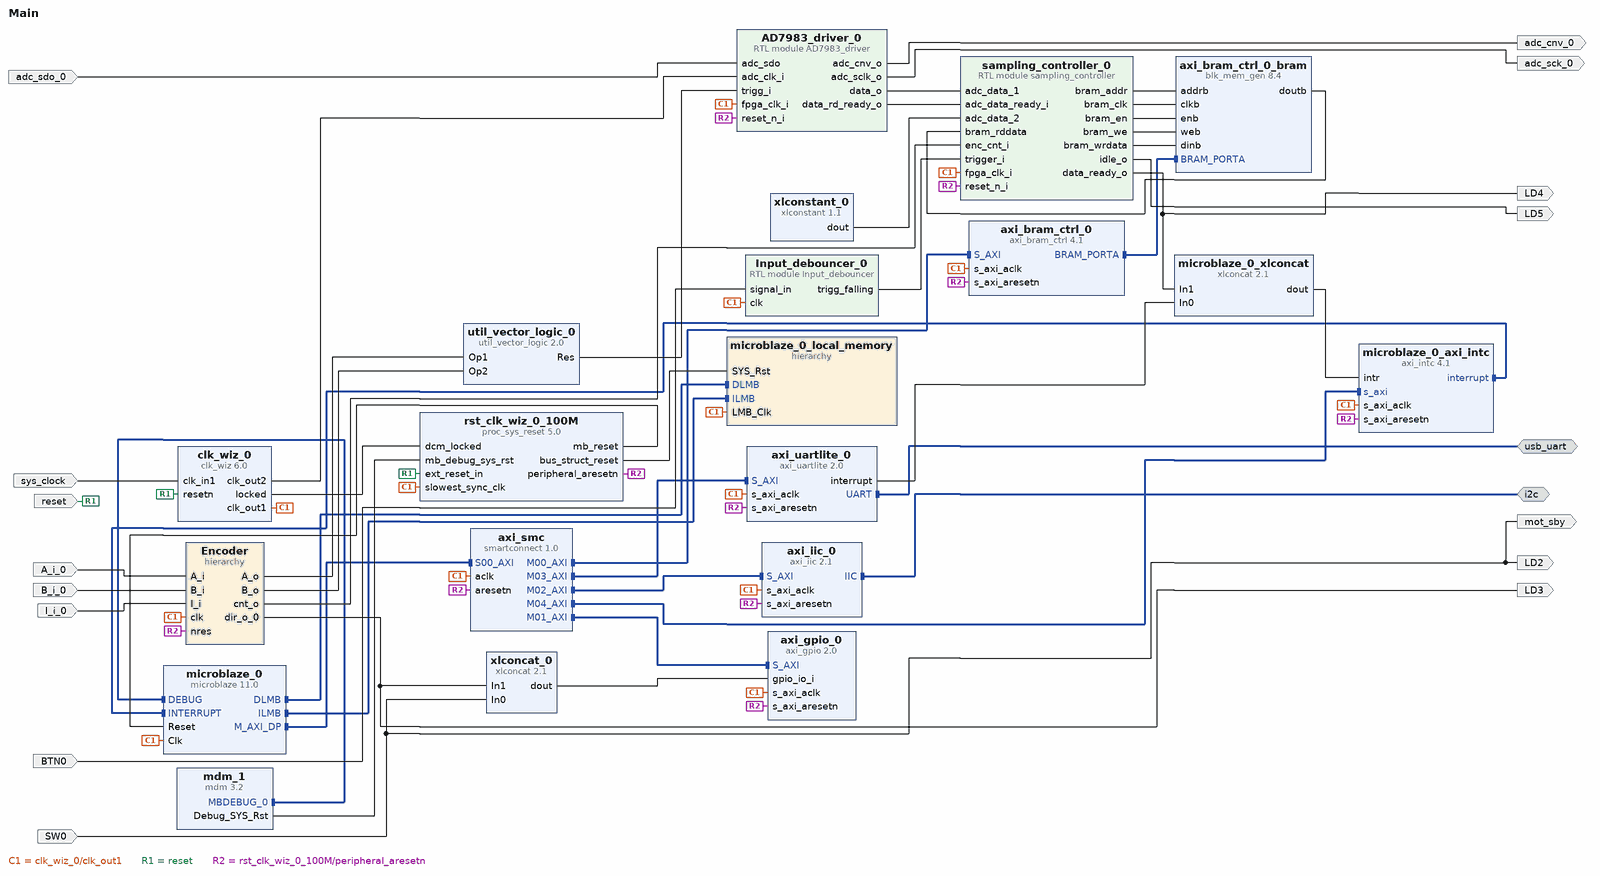
[diagram p0: block diagram of the top level]
# Vivado block design Main, xc7s25csga324-1, Vivado 2022.1
create_bd_design Main

create_bd_intf_port -mode Master -vlnv xilinx.com:interface:uart_rtl:1.0 usb_uart
create_bd_intf_port -mode Master -vlnv xilinx.com:interface:iic_rtl:1.0 i2c
create_bd_port -dir I -type clk sys_clock
set_property -dict {CONFIG.FREQ_HZ 12000000 CONFIG.PHASE 0.0} [get_bd_ports sys_clock]
create_bd_port -dir I -type rst reset
set_property -dict {CONFIG.POLARITY ACTIVE_LOW} [get_bd_ports reset]
create_bd_port -dir I adc_sdo_0
create_bd_port -dir O adc_sck_0
create_bd_port -dir O adc_cnv_0
create_bd_port -dir I A_i_0
create_bd_port -dir I SW0
create_bd_port -dir O LD2
create_bd_port -dir O mot_sby
create_bd_port -dir I I_i_0
create_bd_port -dir O LD3
create_bd_port -dir O LD4
create_bd_port -dir I BTN0
create_bd_port -dir I B_i_0
create_bd_port -dir O LD5

create_bd_cell -type ip -vlnv xilinx.com:ip:microblaze:11.0 microblaze_0
set_property -dict [list \
  CONFIG.C_DEBUG_ENABLED 1 \
  CONFIG.C_D_AXI 1 \
  CONFIG.C_D_LMB 1 \
  CONFIG.C_I_LMB 1 \
  CONFIG.G_USE_EXCEPTIONS 1 \
] [get_bd_cells microblaze_0]
create_bd_cell -type ip -vlnv xilinx.com:ip:clk_wiz:6.0 clk_wiz_0
set_property -dict [list \
  CONFIG.CLKOUT1_JITTER 479.872 \
  CONFIG.CLKOUT1_PHASE_ERROR 668.310 \
  CONFIG.CLKOUT2_JITTER 705.336 \
  CONFIG.CLKOUT2_PHASE_ERROR 668.310 \
  CONFIG.CLKOUT2_REQUESTED_OUT_FREQ 10.000 \
  CONFIG.CLKOUT2_USED true \
  CONFIG.CLK_IN1_BOARD_INTERFACE sys_clock \
  CONFIG.MMCM_CLKFBOUT_MULT_F 62.500 \
  CONFIG.MMCM_CLKOUT0_DIVIDE_F 7.500 \
  CONFIG.MMCM_CLKOUT1_DIVIDE 75 \
  CONFIG.NUM_OUT_CLKS 2 \
  CONFIG.RESET_BOARD_INTERFACE reset \
  CONFIG.RESET_PORT resetn \
  CONFIG.RESET_TYPE ACTIVE_LOW \
  CONFIG.USE_BOARD_FLOW true \
] [get_bd_cells clk_wiz_0]
create_bd_cell -type hier microblaze_0_local_memory
create_bd_cell -type ip -vlnv xilinx.com:ip:axi_intc:4.1 microblaze_0_axi_intc
set_property -dict [list \
  CONFIG.C_EN_CASCADE_MODE 0 \
  CONFIG.C_HAS_FAST 0 \
  CONFIG.C_HAS_ILR 0 \
  CONFIG.C_IRQ_CONNECTION 0 \
  CONFIG.C_IRQ_IS_LEVEL 1 \
  CONFIG.C_NUM_SW_INTR 0 \
] [get_bd_cells microblaze_0_axi_intc]
create_bd_cell -type ip -vlnv xilinx.com:ip:xlconcat:2.1 microblaze_0_xlconcat
set_property -dict {CONFIG.NUM_PORTS 2} [get_bd_cells microblaze_0_xlconcat]
create_bd_cell -type ip -vlnv xilinx.com:ip:mdm:3.2 mdm_1
create_bd_cell -type ip -vlnv xilinx.com:ip:proc_sys_reset:5.0 rst_clk_wiz_0_100M
set_property -dict {CONFIG.RESET_BOARD_INTERFACE reset CONFIG.USE_BOARD_FLOW true} [get_bd_cells rst_clk_wiz_0_100M]
create_bd_cell -type ip -vlnv xilinx.com:ip:axi_uartlite:2.0 axi_uartlite_0
set_property -dict [list \
  CONFIG.C_BAUDRATE 230400 \
  CONFIG.C_ODD_PARITY 0 \
  CONFIG.C_S_AXI_ACLK_FREQ_HZ 100000000 \
  CONFIG.C_USE_PARITY 0 \
  CONFIG.PARITY No_Parity \
  CONFIG.UARTLITE_BOARD_INTERFACE usb_uart \
  CONFIG.USE_BOARD_FLOW true \
] [get_bd_cells axi_uartlite_0]
create_bd_cell -type ip -vlnv xilinx.com:ip:axi_iic:2.1 axi_iic_0
set_property -dict {CONFIG.IIC_BOARD_INTERFACE i2c CONFIG.USE_BOARD_FLOW true} [get_bd_cells axi_iic_0]
create_bd_cell -type ip -vlnv xilinx.com:ip:util_vector_logic:2.0 util_vector_logic_0
set_property -dict {CONFIG.C_OPERATION xor CONFIG.C_SIZE 1} [get_bd_cells util_vector_logic_0]
create_bd_cell -type ip -vlnv xilinx.com:ip:axi_gpio:2.0 axi_gpio_0
set_property -dict {CONFIG.C_ALL_INPUTS 1 CONFIG.C_GPIO_WIDTH 2 CONFIG.C_IS_DUAL 0} [get_bd_cells axi_gpio_0]
create_bd_cell -type ip -vlnv xilinx.com:ip:xlconcat:2.1 xlconcat_0
create_bd_cell -type module -reference Input_debouncer Input_debouncer_0
create_bd_cell -type hier Encoder
create_bd_cell -type ip -vlnv xilinx.com:ip:xlconstant:1.1 xlconstant_0
set_property -dict {CONFIG.CONST_VAL 0 CONFIG.CONST_WIDTH 16} [get_bd_cells xlconstant_0]
create_bd_cell -type ip -vlnv xilinx.com:ip:axi_bram_ctrl:4.1 axi_bram_ctrl_0
set_property -dict {CONFIG.SINGLE_PORT_BRAM 1} [get_bd_cells axi_bram_ctrl_0]
create_bd_cell -type ip -vlnv xilinx.com:ip:blk_mem_gen:8.4 axi_bram_ctrl_0_bram
set_property -dict [list \
  CONFIG.Assume_Synchronous_Clk true \
  CONFIG.Enable_B Use_ENB_Pin \
  CONFIG.Memory_Type True_Dual_Port_RAM \
  CONFIG.Port_B_Clock 100 \
  CONFIG.Port_B_Enable_Rate 100 \
  CONFIG.Port_B_Write_Rate 50 \
  CONFIG.Use_RSTB_Pin true \
] [get_bd_cells axi_bram_ctrl_0_bram]
create_bd_cell -type ip -vlnv xilinx.com:ip:smartconnect:1.0 axi_smc
set_property -dict {CONFIG.NUM_MI 5 CONFIG.NUM_SI 1} [get_bd_cells axi_smc]
create_bd_cell -type module -reference AD7983_driver AD7983_driver_0
create_bd_cell -type module -reference sampling_controller sampling_controller_0

# ---- hierarchy /microblaze_0_local_memory ----
current_bd_instance /microblaze_0_local_memory
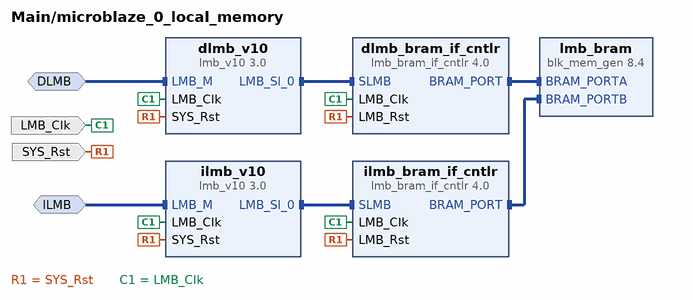
[diagram p1: block diagram inside /microblaze_0_local_memory]
create_bd_intf_pin -mode MirroredMaster -vlnv xilinx.com:interface:lmb_rtl:1.0 DLMB
create_bd_intf_pin -mode MirroredMaster -vlnv xilinx.com:interface:lmb_rtl:1.0 ILMB
create_bd_pin -dir I -type clk LMB_Clk
create_bd_pin -dir I -type rst SYS_Rst

create_bd_cell -type ip -vlnv xilinx.com:ip:lmb_v10:3.0 dlmb_v10
create_bd_cell -type ip -vlnv xilinx.com:ip:lmb_v10:3.0 ilmb_v10
create_bd_cell -type ip -vlnv xilinx.com:ip:lmb_bram_if_cntlr:4.0 dlmb_bram_if_cntlr
set_property -dict {CONFIG.C_ECC 0} [get_bd_cells dlmb_bram_if_cntlr]
create_bd_cell -type ip -vlnv xilinx.com:ip:lmb_bram_if_cntlr:4.0 ilmb_bram_if_cntlr
set_property -dict {CONFIG.C_ECC 0} [get_bd_cells ilmb_bram_if_cntlr]
create_bd_cell -type ip -vlnv xilinx.com:ip:blk_mem_gen:8.4 lmb_bram
set_property -dict {CONFIG.Memory_Type True_Dual_Port_RAM CONFIG.use_bram_block BRAM_Controller} [get_bd_cells lmb_bram]

# ---- hierarchy /Encoder ----
current_bd_instance /Encoder
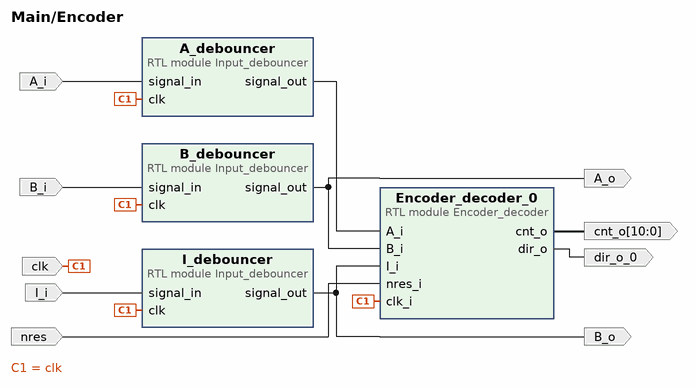
[diagram p2: block diagram inside /Encoder]
create_bd_pin -dir I nres
create_bd_pin -dir I -type clk clk
create_bd_pin -dir I A_i
create_bd_pin -dir I B_i
create_bd_pin -dir I I_i
create_bd_pin -dir O -from 10 -to 0 cnt_o
create_bd_pin -dir O dir_o_0
create_bd_pin -dir O A_o
create_bd_pin -dir O B_o

create_bd_cell -type module -reference Encoder_decoder Encoder_decoder_0
create_bd_cell -type module -reference Input_debouncer A_debouncer
create_bd_cell -type module -reference Input_debouncer B_debouncer
create_bd_cell -type module -reference Input_debouncer I_debouncer

# ---- connections ----

current_bd_instance /microblaze_0_local_memory
connect_bd_intf_net -intf_net microblaze_0_dlmb [get_bd_intf_pins DLMB] [get_bd_intf_pins dlmb_v10/LMB_M]
connect_bd_intf_net -intf_net microblaze_0_dlmb_bus [get_bd_intf_pins dlmb_v10/LMB_Sl_0] [get_bd_intf_pins dlmb_bram_if_cntlr/SLMB]
connect_bd_intf_net -intf_net microblaze_0_dlmb_cntlr [get_bd_intf_pins dlmb_bram_if_cntlr/BRAM_PORT] [get_bd_intf_pins lmb_bram/BRAM_PORTA]
connect_bd_intf_net -intf_net microblaze_0_ilmb [get_bd_intf_pins ILMB] [get_bd_intf_pins ilmb_v10/LMB_M]
connect_bd_intf_net -intf_net microblaze_0_ilmb_bus [get_bd_intf_pins ilmb_v10/LMB_Sl_0] [get_bd_intf_pins ilmb_bram_if_cntlr/SLMB]
connect_bd_intf_net -intf_net microblaze_0_ilmb_cntlr [get_bd_intf_pins ilmb_bram_if_cntlr/BRAM_PORT] [get_bd_intf_pins lmb_bram/BRAM_PORTB]
connect_bd_net [get_bd_pins SYS_Rst] \
  [get_bd_pins dlmb_v10/SYS_Rst] [get_bd_pins dlmb_bram_if_cntlr/LMB_Rst] [get_bd_pins ilmb_v10/SYS_Rst] \
  [get_bd_pins ilmb_bram_if_cntlr/LMB_Rst]
connect_bd_net -net microblaze_0_Clk [get_bd_pins LMB_Clk] \
  [get_bd_pins dlmb_v10/LMB_Clk] [get_bd_pins dlmb_bram_if_cntlr/LMB_Clk] [get_bd_pins ilmb_v10/LMB_Clk] \
  [get_bd_pins ilmb_bram_if_cntlr/LMB_Clk]
set_property HDL_ATTRIBUTE.BMM_INFO_ADDRESS_SPACE {byte  0x00000000 32 > Main microblaze_0_local_memory/lmb_bram} [get_bd_cells dlmb_bram_if_cntlr]
set_property HDL_ATTRIBUTE.KEEP_HIERARCHY yes [get_bd_cells dlmb_bram_if_cntlr]

current_bd_instance /Encoder
connect_bd_net [get_bd_pins A_debouncer/signal_out] [get_bd_pins Encoder_decoder_0/A_i]
connect_bd_net [get_bd_pins B_debouncer/signal_out] [get_bd_pins Encoder_decoder_0/B_i] [get_bd_pins A_o]
connect_bd_net [get_bd_pins Encoder_decoder_0/cnt_o] [get_bd_pins cnt_o]
connect_bd_net [get_bd_pins Encoder_decoder_0/dir_o] [get_bd_pins dir_o_0]
connect_bd_net [get_bd_pins I_debouncer/signal_out] [get_bd_pins Encoder_decoder_0/I_i] [get_bd_pins B_o]
connect_bd_net -net clk_0_1 [get_bd_pins clk] \
  [get_bd_pins B_debouncer/clk] [get_bd_pins I_debouncer/clk] [get_bd_pins A_debouncer/clk] \
  [get_bd_pins Encoder_decoder_0/clk_i]
connect_bd_net -net nres_i_0_1 [get_bd_pins nres] [get_bd_pins Encoder_decoder_0/nres_i]
connect_bd_net -net signal_in_0_1 [get_bd_pins A_i] [get_bd_pins A_debouncer/signal_in]
connect_bd_net -net signal_in_1_1 [get_bd_pins B_i] [get_bd_pins B_debouncer/signal_in]
connect_bd_net -net signal_in_2_1 [get_bd_pins I_i] [get_bd_pins I_debouncer/signal_in]

current_bd_instance /
connect_bd_intf_net [get_bd_intf_pins axi_bram_ctrl_0_bram/BRAM_PORTA] [get_bd_intf_pins axi_bram_ctrl_0/BRAM_PORTA]
connect_bd_intf_net [get_bd_intf_ports i2c] [get_bd_intf_pins axi_iic_0/IIC]
connect_bd_intf_net [get_bd_intf_pins axi_smc/M00_AXI] [get_bd_intf_pins axi_bram_ctrl_0/S_AXI]
connect_bd_intf_net [get_bd_intf_pins axi_smc/M01_AXI] [get_bd_intf_pins axi_gpio_0/S_AXI]
connect_bd_intf_net [get_bd_intf_pins axi_smc/M02_AXI] [get_bd_intf_pins axi_iic_0/S_AXI]
connect_bd_intf_net [get_bd_intf_pins axi_smc/M03_AXI] [get_bd_intf_pins axi_uartlite_0/S_AXI]
connect_bd_intf_net [get_bd_intf_pins axi_smc/M04_AXI] [get_bd_intf_pins microblaze_0_axi_intc/s_axi]
connect_bd_intf_net [get_bd_intf_ports usb_uart] [get_bd_intf_pins axi_uartlite_0/UART]
connect_bd_intf_net [get_bd_intf_pins microblaze_0/M_AXI_DP] [get_bd_intf_pins axi_smc/S00_AXI]
connect_bd_intf_net [get_bd_intf_pins microblaze_0_axi_intc/interrupt] [get_bd_intf_pins microblaze_0/INTERRUPT]
connect_bd_intf_net [get_bd_intf_pins mdm_1/MBDEBUG_0] [get_bd_intf_pins microblaze_0/DEBUG]
connect_bd_intf_net [get_bd_intf_pins microblaze_0/DLMB] [get_bd_intf_pins microblaze_0_local_memory/DLMB]
connect_bd_intf_net [get_bd_intf_pins microblaze_0/ILMB] [get_bd_intf_pins microblaze_0_local_memory/ILMB]
connect_bd_net -net AD7983_driver_0_adc_cnv [get_bd_pins AD7983_driver_0/adc_cnv_o] [get_bd_ports adc_cnv_0]
connect_bd_net -net AD7983_driver_0_adc_sck [get_bd_pins AD7983_driver_0/adc_sclk_o] [get_bd_ports adc_sck_0]
connect_bd_net [get_bd_pins AD7983_driver_0/data_o] [get_bd_pins sampling_controller_0/adc_data_1]
connect_bd_net [get_bd_pins AD7983_driver_0/data_rd_ready_o] [get_bd_pins sampling_controller_0/adc_data_ready_i]
connect_bd_net -net A_i_0_1 [get_bd_ports A_i_0] [get_bd_pins Encoder/A_i]
connect_bd_net -net B_i_0_1 [get_bd_ports B_i_0] [get_bd_pins Encoder/B_i]
connect_bd_net -net DSP_data_ready_o [get_bd_pins sampling_controller_0/data_ready_o] [get_bd_pins microblaze_0_xlconcat/In1] [get_bd_ports LD4]
connect_bd_net [get_bd_pins Encoder/cnt_o] [get_bd_pins sampling_controller_0/enc_cnt_i]
connect_bd_net [get_bd_pins Encoder/dir_o_0] [get_bd_ports LD3] [get_bd_pins xlconcat_0/In1]
connect_bd_net -net Encoder_signal_out [get_bd_pins Encoder/A_o] [get_bd_pins util_vector_logic_0/Op1]
connect_bd_net -net Encoder_signal_out1 [get_bd_pins Encoder/B_o] [get_bd_pins util_vector_logic_0/Op2]
connect_bd_net -net I_i_0_1 [get_bd_ports I_i_0] [get_bd_pins Encoder/I_i]
connect_bd_net [get_bd_pins Input_debouncer_0/trigg_falling] [get_bd_pins sampling_controller_0/trigger_i]
connect_bd_net -net SW0_1 [get_bd_ports SW0] [get_bd_ports LD2] [get_bd_ports mot_sby] [get_bd_pins xlconcat_0/In0]
connect_bd_net -net adc_sdo_0_1 [get_bd_ports adc_sdo_0] [get_bd_pins AD7983_driver_0/adc_sdo]
connect_bd_net [get_bd_pins axi_bram_ctrl_0_bram/doutb] [get_bd_pins sampling_controller_0/bram_rddata]
connect_bd_net [get_bd_pins axi_uartlite_0/interrupt] [get_bd_pins microblaze_0_xlconcat/In0]
connect_bd_net [get_bd_pins clk_wiz_0/clk_out2] [get_bd_pins AD7983_driver_0/adc_clk_i]
connect_bd_net [get_bd_pins clk_wiz_0/locked] [get_bd_pins rst_clk_wiz_0_100M/dcm_locked]
connect_bd_net [get_bd_pins mdm_1/Debug_SYS_Rst] [get_bd_pins rst_clk_wiz_0_100M/mb_debug_sys_rst]
connect_bd_net -net microblaze_0_Clk [get_bd_pins clk_wiz_0/clk_out1] \
  [get_bd_pins microblaze_0/Clk] [get_bd_pins microblaze_0_axi_intc/s_axi_aclk] \
  [get_bd_pins microblaze_0_local_memory/LMB_Clk] [get_bd_pins rst_clk_wiz_0_100M/slowest_sync_clk] \
  [get_bd_pins axi_uartlite_0/s_axi_aclk] [get_bd_pins axi_iic_0/s_axi_aclk] [get_bd_pins axi_gpio_0/s_axi_aclk] \
  [get_bd_pins Input_debouncer_0/clk] [get_bd_pins axi_bram_ctrl_0/s_axi_aclk] [get_bd_pins axi_smc/aclk] \
  [get_bd_pins Encoder/clk] [get_bd_pins AD7983_driver_0/fpga_clk_i] [get_bd_pins sampling_controller_0/fpga_clk_i]
connect_bd_net -net microblaze_0_intr [get_bd_pins microblaze_0_xlconcat/dout] [get_bd_pins microblaze_0_axi_intc/intr]
connect_bd_net [get_bd_ports reset] [get_bd_pins clk_wiz_0/resetn] [get_bd_pins rst_clk_wiz_0_100M/ext_reset_in]
connect_bd_net [get_bd_pins rst_clk_wiz_0_100M/bus_struct_reset] [get_bd_pins microblaze_0_local_memory/SYS_Rst]
connect_bd_net [get_bd_pins rst_clk_wiz_0_100M/mb_reset] [get_bd_pins microblaze_0/Reset]
connect_bd_net [get_bd_pins rst_clk_wiz_0_100M/peripheral_aresetn] \
  [get_bd_pins microblaze_0_axi_intc/s_axi_aresetn] [get_bd_pins axi_uartlite_0/s_axi_aresetn] \
  [get_bd_pins axi_iic_0/s_axi_aresetn] [get_bd_pins axi_gpio_0/s_axi_aresetn] [get_bd_pins axi_bram_ctrl_0/s_axi_aresetn] \
  [get_bd_pins axi_smc/aresetn] [get_bd_pins Encoder/nres] [get_bd_pins AD7983_driver_0/reset_n_i] \
  [get_bd_pins sampling_controller_0/reset_n_i]
connect_bd_net [get_bd_pins sampling_controller_0/bram_addr] [get_bd_pins axi_bram_ctrl_0_bram/addrb]
connect_bd_net [get_bd_pins sampling_controller_0/bram_clk] [get_bd_pins axi_bram_ctrl_0_bram/clkb]
connect_bd_net [get_bd_pins sampling_controller_0/bram_en] [get_bd_pins axi_bram_ctrl_0_bram/enb]
connect_bd_net [get_bd_pins sampling_controller_0/bram_we] [get_bd_pins axi_bram_ctrl_0_bram/web]
connect_bd_net [get_bd_pins sampling_controller_0/bram_wrdata] [get_bd_pins axi_bram_ctrl_0_bram/dinb]
connect_bd_net [get_bd_pins sampling_controller_0/idle_o] [get_bd_ports LD5]
connect_bd_net -net signal_in_0_1 [get_bd_ports BTN0] [get_bd_pins Input_debouncer_0/signal_in]
connect_bd_net [get_bd_ports sys_clock] [get_bd_pins clk_wiz_0/clk_in1]
connect_bd_net [get_bd_pins util_vector_logic_0/Res] [get_bd_pins AD7983_driver_0/trigg_i]
connect_bd_net [get_bd_pins xlconcat_0/dout] [get_bd_pins axi_gpio_0/gpio_io_i]
connect_bd_net [get_bd_pins xlconstant_0/dout] [get_bd_pins sampling_controller_0/adc_data_2]
set_property HDL_ATTRIBUTE.BMM_INFO_PROCESSOR {microblaze-le > Main microblaze_0_local_memory/dlmb_bram_if_cntlr Main axi_bram_ctrl_0} [get_bd_cells microblaze_0]
set_property HDL_ATTRIBUTE.KEEP_HIERARCHY yes [get_bd_cells microblaze_0]
set_property HDL_ATTRIBUTE.BMM_INFO_ADDRESS_SPACE {byte  0xC0000000 32 > Main axi_bram_ctrl_0_bram} [get_bd_cells axi_bram_ctrl_0]
set_property HDL_ATTRIBUTE.KEEP_HIERARCHY yes [get_bd_cells axi_bram_ctrl_0]

# ---- address map ----
assign_bd_address -offset 0x00000000 -range 32K -target_address_space [get_bd_addr_spaces microblaze_0/Data] [get_bd_addr_segs microblaze_0_local_memory/dlmb_bram_if_cntlr/SLMB/Mem]
assign_bd_address -offset 0x40000000 -range 64K -target_address_space [get_bd_addr_spaces microblaze_0/Data] [get_bd_addr_segs axi_gpio_0/S_AXI/Reg]
assign_bd_address -offset 0x40600000 -range 64K -target_address_space [get_bd_addr_spaces microblaze_0/Data] [get_bd_addr_segs axi_uartlite_0/S_AXI/Reg]
assign_bd_address -offset 0x40800000 -range 64K -target_address_space [get_bd_addr_spaces microblaze_0/Data] [get_bd_addr_segs axi_iic_0/S_AXI/Reg]
assign_bd_address -offset 0x41200000 -range 64K -target_address_space [get_bd_addr_spaces microblaze_0/Data] [get_bd_addr_segs microblaze_0_axi_intc/S_AXI/Reg]
assign_bd_address -offset 0xC0000000 -range 8K -target_address_space [get_bd_addr_spaces microblaze_0/Data] [get_bd_addr_segs axi_bram_ctrl_0/S_AXI/Mem0]
assign_bd_address -offset 0x00000000 -range 32K -target_address_space [get_bd_addr_spaces microblaze_0/Instruction] [get_bd_addr_segs microblaze_0_local_memory/ilmb_bram_if_cntlr/SLMB/Mem]

set_property USER_COMMENTS.comment_8 {Encoders can produce
noisy signals. Therefore
a debouncer should be
used} [get_bd_cells /Encoder/B_debouncer]
set_property USER_COMMENTS.comment_4 {We can use the debouncer to
output a pulse when a button is
pressed/released. This is then used
as a start signal for the sampling 
controller. This way we can prevent 
the core from continously
running when the button is held} [get_bd_cells /Input_debouncer_0]
set_property USER_COMMENTS.comment_3 {adc_sdo_0 - JA pin 3
I_i_0 - JC pin 1
A_i_0 - JC pin 2
B_i_0 - JC pin 3} [get_bd_cells /adc_sdo_0]
set_property USER_COMMENTS.comment_2 {adc_sck_0 - JA pin 4
adc_cnv_0 - JA pin 1
mot_sby -  IO9} [get_bd_cells /mot_sby]
set_property USER_COMMENTS.comment_5 {Output of the XOR gate on bot
quadrature encoder outputs
will change state for every encoder
step. We'll use this to trigger the ADC} [get_bd_cells /util_vector_logic_0]

validate_bd_design
save_bd_design
